# Altium schematic sheet Peripherals.SchDoc
size A4; SheetNumber: 3; SheetTotal: 5
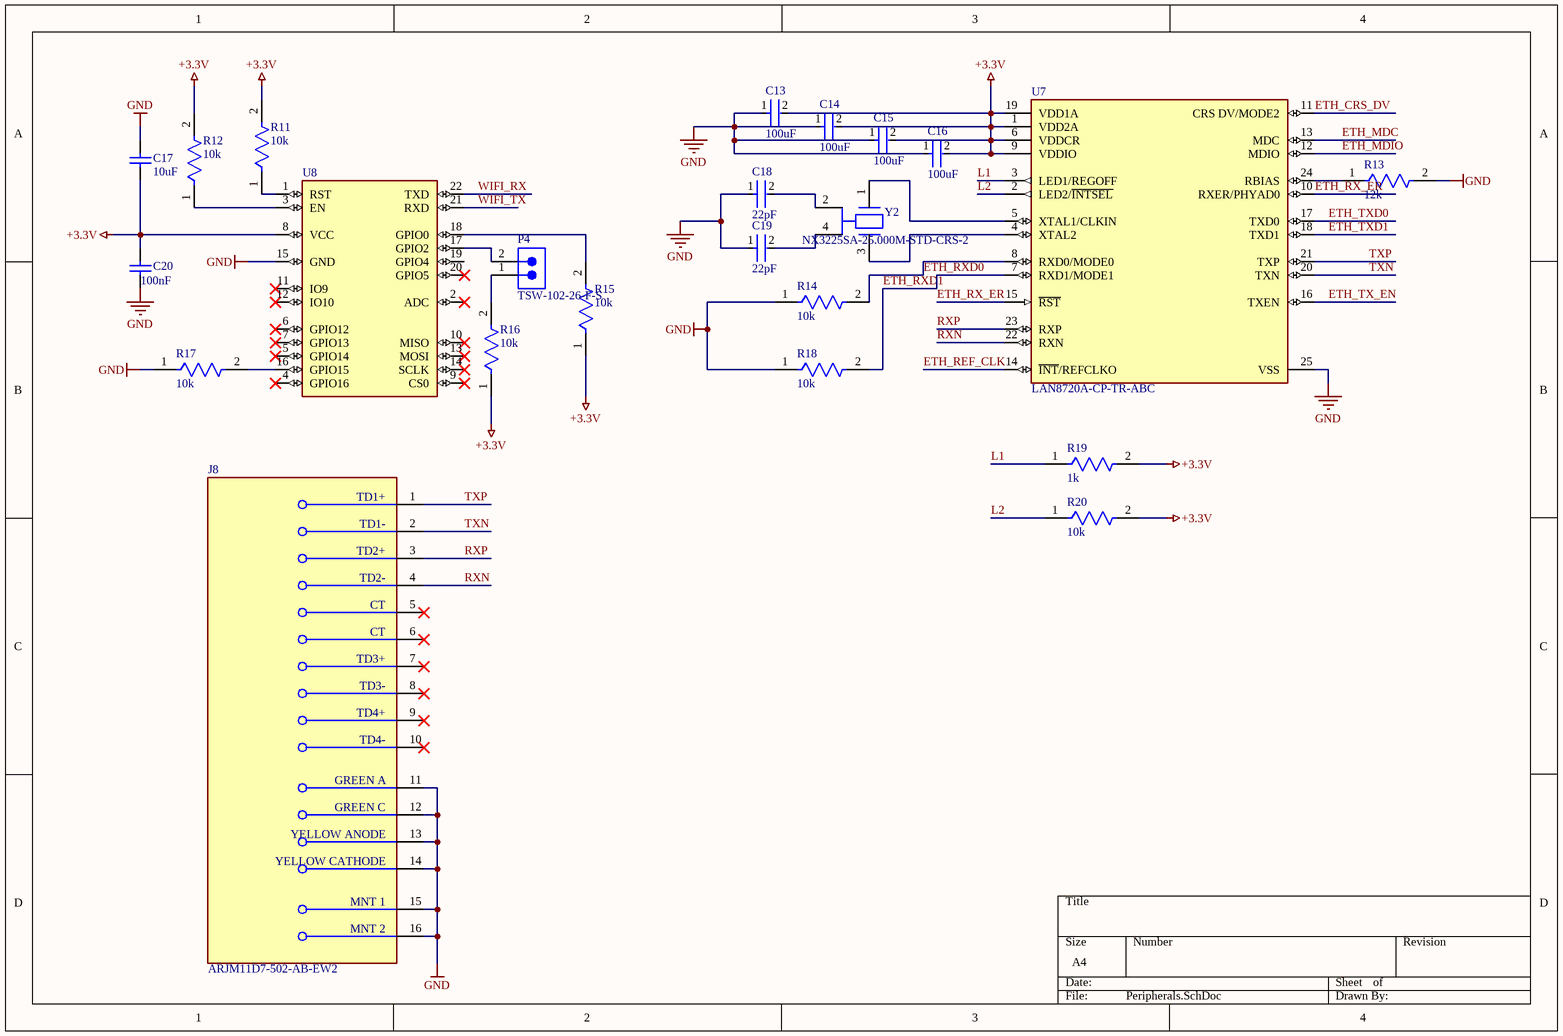
[diagram p0: Peripherals.SchDoc]

## Parts
C13  100uF  [FP-GRM21B-0_2-e0_2_0_7-IPC_A]
C14  100uF  [FP-GRM21B-0_2-e0_2_0_7-IPC_A]
C15  100uF  [FP-GRM21B-0_2-e0_2_0_7-IPC_A]
C16  100uF  [FP-GRM21B-0_2-e0_2_0_7-IPC_A]
C17  10uF  [CAPC2013X140X50ML20T25]
C18  22pF  [FP-C0805C-DN-MFG]
C19  22pF  [FP-C0805C-DN-MFG]
C20  100nF  [CAPC2013X145X50NL20T25]
J8  ARJM11D7-502-AB-EW2  [FP-ARJM11D7-502-AB-EW2-MFG]
P4  TSW-102-26-F-S  [SMTC-TSW-102-26-XX-S]
R11  10k  [FP-CRGP0805-IPC_C]
R12  10k  [FP-CRGP0805-IPC_C]
R13  12k  [FP-CRGCQ0805-IPC_C]
R14  10k  [FP-CRGP0805-IPC_C]
R15  10k  [FP-CRGP0805-IPC_C]
R16  10k  [FP-CRGP0805-IPC_C]
R17  10k  [FP-CRGP0805-IPC_C]
R18  10k  [FP-CRGP0805-IPC_C]
R19  1k  [FP-RN73R2A-IPC_A]
R20  10k  [FP-CRGP0805-IPC_C]
U7  LAN8720A-CP-TR-ABC  [FP-24-S4QFN-4x4B-0_5P-IPC_B]
U8  (no value)  [ESP-12F]
Y2  NX3225SA-25.000M-STD-CRS-2  [FP-NX3225SA-MFG]

## Nets
+3.3V: C13.2 C14.2 C15.2 C16.2 C17.1 C20.2 R11.2 R12.2 R15.1 R16.1 R19.2 R20.2 U7.1(VDD2A) U7.6(VDDCR) U7.9(VDDIO) U7.19(VDD1A) U8.8(VCC)
GND: C13.1 C14.1 C15.1 C16.1 C17.2 C18.1 C19.1 C20.1 J8.11(GREEN_A) J8.12(GREEN_C) J8.13(YELLOW_ANODE) J8.14(YELLOW_CATHODE) J8.15(MNT_1) J8.16(MNT_2) R13.2 R14.1 R17.1 R18.1 U7.25(VSS) U8.15(GND)
ETH_CRS_DV: U7.11(CRS_DV/MODE2)
ETH_MDC: U7.13(MDC)
ETH_MDIO: U7.12(MDIO)
ETH_REF_CLK: U7.14(~{INT}/REFCLKO)
ETH_RX_ER: U7.10(RXER/PHYAD0) U7.15(~{RST})
ETH_RXD0: R14.2 U7.8(RXD0/MODE0)
ETH_RXD1: R18.2 U7.7(RXD1/MODE1)
ETH_TX_EN: U7.16(TXEN)
ETH_TXD0: U7.17(TXD0)
ETH_TXD1: U7.18(TXD1)
L1: R19.1 U7.3(LED1/REGOFF)
L2: R20.1 U7.2(LED2/~{INTSEL})
RXN: J8.4(TD2-) U7.22(RXN)
RXP: J8.3(TD2+) U7.23(RXP)
TXN: J8.2(TD1-) U7.20(TXN)
TXP: J8.1(TD1+) U7.21(TXP)
WIFI_RX: U8.22(TXD)
WIFI_TX: U8.21(RXD)
NetC18_2: C18.2 Y2.2(GND)
NetC19_2: C19.2 Y2.4(GND)
NetP4_1: P4.1 R16.2
NetP4_2: P4.2 U8.17(GPIO2)
NetR11_1: R11.1 U8.1(RST)
NetR12_1: R12.1 U8.3(EN)
NetR13_1: R13.1 U7.24(RBIAS)
NetR15_2: R15.2 U8.18(GPIO0)
NetR17_2: R17.2 U8.16(GPIO15)
NetU7_4: U7.4(XTAL2) Y2.3
NetU7_5: U7.5(XTAL1/CLKIN) Y2.1

Not connected (* = marked no-connect by the designer): J8 5(CT)* 6(CT)* 7(TD3+)* 8(TD3-)* 9(TD4+)* 10(TD4-)*; U8 2(ADC)* 4(GPIO16)* 5(GPIO14)* 6(GPIO12)* 7(GPIO13)* 9(CS0)* 10(MISO)* 11(IO9)* 12(IO10)* 13(MOSI)* 14(SCLK)* 19(GPIO4) 20(GPIO5)*

## Library data of the parts
C13-C16 = CMP-06035-016811-1: Chip Multilayer Ceramic Capacitors for General Purpose, 0805, 100uF, X6S, 22%, 20%, 2.5V; Voltage Rating (DC): 2.5V; Capacitance: 100uF; Width: 0.049inch; Case Code (Metric): 2012; Dielectric: X6S; Thickness: 0.057inch; Tolerance: 20%; Length: 0.079inch; Packaging: Tape and Reel; Case/Package: 0805; Case Code (Imperial): 0805; Min Operating Temperature: -55°C; Max Operating Temperature: 105°C; Voltage Rating: 2.5V; Mount: Surface Mount
C17 = CMP-2007-04702-1: Manufacturer: AVX Interconnect / Elco; Part Number: 0805ZC106KAT2A
C18 C19 = CMP-2007-00314-2: CAP CER 22PF 100V 10% NP0 0805; Manufacturer Part Number: C0805C220K1GACTU; Manufacturer: KEMET; Temperature Characteristic: C0G; Tolerance: 0.1; Material: Ceramic; Temperature Coefficient: 30ppm/°C; ComponentLink2Description: Datasheet; Digikey Description: CAP CER 22PF 100V 10% NP0 0805; Value: 22 pF; Temperature Range High: +125°C; Package: C0805C-DN; Voltage Rating: 100 V; Octopart: https://octopart.com/c0805c220k1gactu-kemet-9138624; Capacitance: 22 pF; Lead Free: Yes; Temperature: -55°C to +125°C; Category: Cap; Device Class L3: Ceramic Capacitors; ComponentLink2URL: https://content.kemet.com/datasheets/KEM_C1003_C0G_SMD.pdf; Ipc Land Pattern Name: CAPC200125X78; Automotive: No; Mouser Description: Cap Ceramic 22pF 100V C0G 10% SMD 0805 125°C Plastic T/R; RoHS: TRUE; Height: 0.88mm; Device Class L1: Passive Components; Temperature Range Low: -55°C; Device Class L2: Capacitors
C20 = CMP-2007-01227-1: Manufacturer: Kemet; Part Number: C0805S104K5RACTU
J8 = CMP-27893-000003-1: CONN JACK 1PORT 1000 BASE-T PCB; Number of Ports: 1; Connector Type: RJ45; Shielding: Shielded; Direction: Up; Number of Cores per Jack: 8; Max Operating Temperature: 85°C; Min Operating Temperature: -40°C; Contact Plating: Gold; RoHS Compliant: Yes; Termination: Solder; Mount: Through Hole; Color: Green; Number of Rows: 1; Packaging: Tray
P4 = CMP-1024-00329-1: 0.025" SQ Post Header, Through-hole, Vertical, -55 to 125 degC, 2.54 mm Pitch, 2-Pin, Male, RoHS; Manufacturer: Samtec; Pitch: 2.54 mm; PackageVersion: DM, 8/1988; ComponentLink2Description: Datasheet; PackageReference: TSW-102-26-XX-S; ComponentLink3URL: http://www.samtec.com/documents/webfiles/cpdf/TSW-XXX-XX-XXX-X-XX-XXX-MKT.pdf; ComponentLink2URL: http://www.samtec.com/documents/webfiles/pdf/TSW_TH.PDF; ComponentLink1Description: Manufacturer URL; DatasheetVersion: F-214; RoHS: True; ComponentLink3Description: Package Specification; PartNumber: TSW-102-26-F-S; Temperature Range: -55 to 125 degC; Orientation: Vertical; ComponentLink1URL: http://www.samtec.com; PackageDescription: .025[0.64] SQ. Post Terminal Strip Assembly; Mounting Technology: Through-hole
R11 R12 R14-R18 R20 = CMP-03211-006861-1: CRGP 0805 10K 1%; Manufacturer Part Number: CRGP0805F10K; Manufacturer: TE; Power Rating: 0.33W; Voltage Rating: 150V; Value: 10KΩ; Tolerance: 0.01; Temperature Coefficient: ±100ppm/°C; ComponentLink2URL: https://www.mouser.com/datasheet/2/418/NG_DS_9-1773463-9_A-1358566.pdf; Temperature Range Low: -55°C; Ipc Land Pattern Name: RESC200125X55; Device Class L2: Resistors; Automotive: No; Device Class L3: Chip SMD Resistors; Composition: Thick Film; Temperature Range High: +155°C; Temperature: -55°C to +155°C; Height: 0.65mm; Series: CRGP; RoHS: TRUE; Device Class L1: Passive Components; Octopart: https://octopart.com/crgp0805f10k-te+connectivity-91018782; Package: CRGP0805; Digikey Description: CRGP 0805 10K 1%; Ambient Temperature Range High: +70°C; Lead Free: Yes; ComponentLink2Description: Datasheet; Category: Res; Resistance: 10KΩ
R13 = CMP-03211-010457-1: CRGCQ 0805 12K 1%; Manufacturer Part Number: CRGCQ0805F12K; Manufacturer: TE Connectivity; Automotive Grade: Grade 929; Tolerance: 0.01; Voltage Rating: 150V; Power Rating: 0.125W; Resistance: 12KΩ; Value: 12KΩ; Temperature Coefficient: ±100ppm/°C; Ipc Land Pattern Name: RESC200125X55; Temperature Range High: +155°C; Automotive: Yes; Ambient Temperature Range High: +70°C; Digikey Description: CRGCQ 0805 12K 1%; ComponentLink2Description: Datasheet; Height: 0.65mm; ComponentLink2URL: https://www.te.com/commerce/DocumentDelivery/DDEController?Action=showdoc&DocId=Data+Sheet%7F1773204-3%7F1%7Fpdf%7FEnglish%7FENG_DS_1773204-3_1.pdf%7F4-2176341-938; Device Class L2: Resistors; RoHS: TRUE; Temperature Range Low: -55°C; Octopart: https://octopart.com/crgcq0805f12k-te+connectivity-91018144; Category: Res; Composition: Thick Film; Package: CRGCQ0805; Device Class L3: Chip SMD Resistors; Temperature: -55°C to +155°C; Device Class L1: Passive Components; Lead Free: Yes; Series: CRGCQ
R19 = CMP-04015-026717-1: 1kΩ ±0.1% 0.125W, 1/8W Chip Resistor 0805 (2012 Metric) Moisture Resistant Thin Film
U7 = CMP-06281-000039-1: IC TRANSCEIVER FULL 2/2 24SQFN; Simplex/Duplex: Full Duplex; Max Operating Temperature: 85°C; Packaging: Tape and Reel; Min Operating Temperature: 0°C; Mount: Surface Mount
U8 = ESP-12F: WiFi Module; MF: AI-Thinker; SnapEDA_Link: https://www.snapeda.com/parts/ESP-12F/AI-Thinker/view-part/?ref=snap; Package: Package; Value: *; MP: ESP-12F; Check_prices: https://www.snapeda.com/parts/ESP-12F/AI-Thinker/view-part/?ref=eda; Supplier 1: Mouser; Supplier Part Number 1: 485-2491
Y2 = CMP-200220-000002-1: CRYSTAL 25.0000MHZ 8PF SMD; Manufacturer: NDK; Frequency: 25MHz; Automotive Grade: Grade 1; Esr: 100Ω; Tolerance: 15ppm; Digikey Description: CRYSTAL 25.0000MHZ 8PF SMD; Temperature Range Low: -40°C; Octopart: https://octopart.com/nx3225sa-25.000m-std-crs-2-ndk-51374293; Series: NX3225SA; Manufacturer Part Number: NX3225SA-25.000M-STD-CRS-2; ComponentLink2URL: https://www.ndk.com/images/products/catalog/c_NX3225SA-STD-CRS-2_e.pdf; Lead Free: Yes; Device Class L2: Crystals / Oscillators; ComponentLink2Description: Datasheet; Device Class L3: Crystals; Category: Crys; Device Class L1: Passive Components; Automotive: Yes; RoHS: TRUE; Load Capacitance: 8pF; Height: 0.6mm; Temperature Range High: +125°C; Package: NX3225SA; Temperature: -40°C to +125°C